# EAGLE design working (EAGLE 9.6.2)
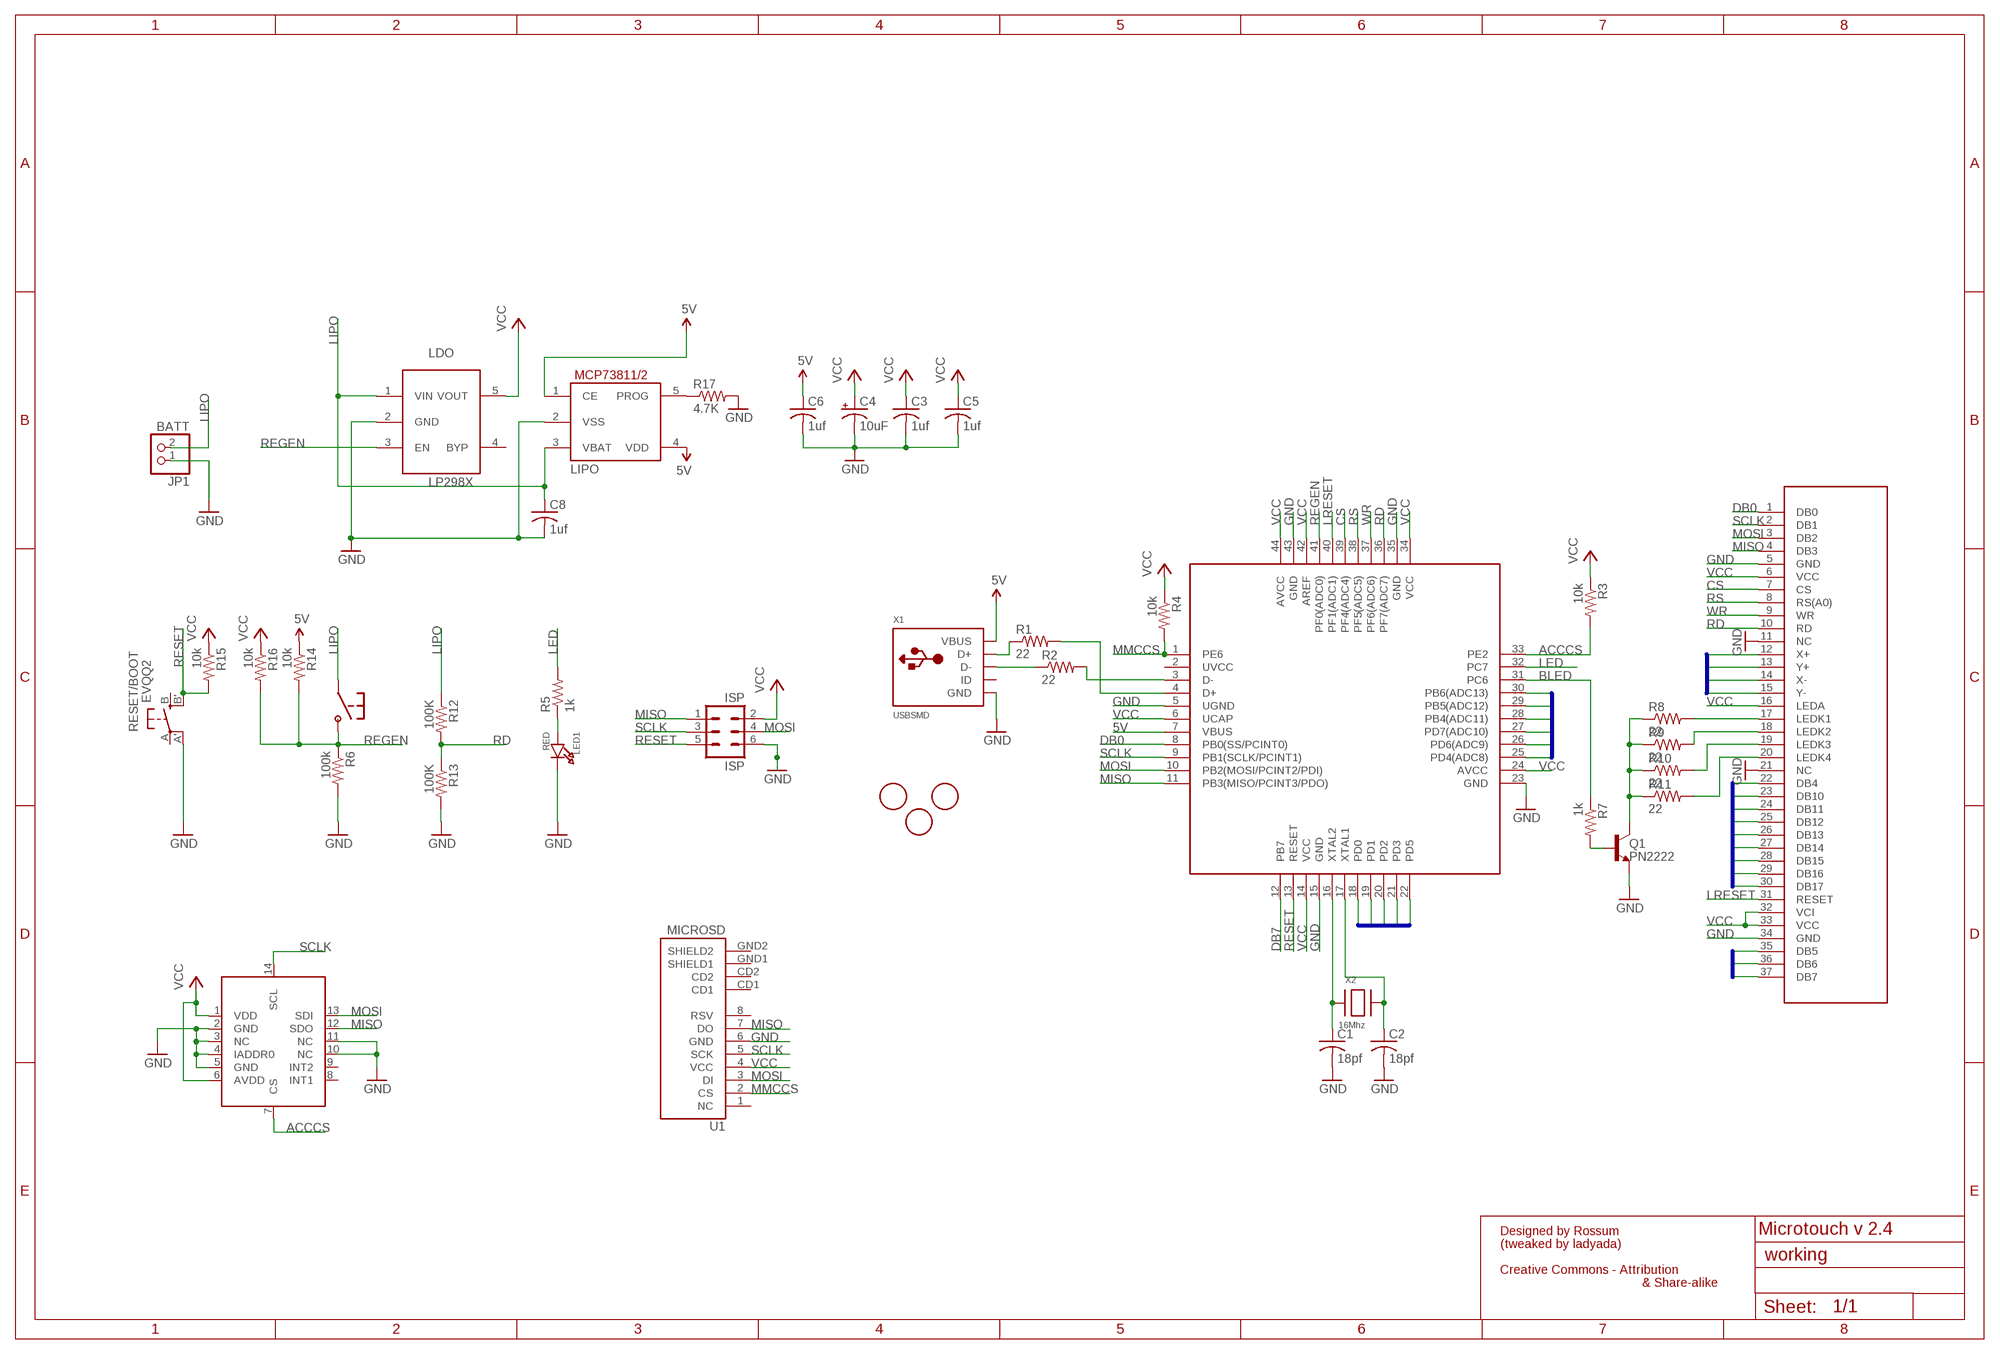
[diagram p0: schematic, sheet 1]

## Parts
ACCELEROMERTER  MMA7455  [LGA]
C1  18pf  C-USC0805K  [C0805K]
C2  18pf  C-USC0805K  [C0805K]
C3  1uf  C-USC0805K  [C0805K]
C4  10uF  CPOL-USA/3216-18R  [A/3216-18R]
C5  1uf  C-USC0805K  [C0805K]
C6  1uf  C-USC0805K  [C0805K]
C8  1uf  C-USC0805K  [C0805K]
ISP  ISP  MA03-2  [MA03-2]
JP1  BATT  JST_2PIN  [JSTPH2]
LDO  LP298XS  [SOT23-5L]
LED1  RED  LED0805  [CHIPLED_0805]
LIPO  MCP73811/2  [SOT23-5L]
Q1  PN2222  MMBT2222ALT1-NPN-SOT23-BEC  [SOT23-BEC]
R1  22  R-US_R0805  [R0805]
R2  22  R-US_R0805  [R0805]
R3  10k  R-US_M0805  [M0805]
R4  10k  R-US_R0805  [R0805]
R5  1k  R-US_R0805  [R0805]
R6  100k  R-US_R0805  [R0805]
R7  1k  R-US_R0805  [R0805]
R8  22  R-US_R0805  [R0805]
R9  22  R-US_R0805  [R0805]
R10  22  R-US_R0805  [R0805]
R11  22  R-US_R0805  [R0805]
R12  100K  R-US_M0805  [M0805]
R13  100K  R-US_M0805  [M0805]
R14  10k  R-US_R0805  [R0805]
R15  10k  R-US_M0805  [M0805]
R16  10k  R-US_R0805  [R0805]
R17  4.7K  R-US_M0805  [M0805]
RESET/BOOT  EVQQ2  [EVQ-Q2]
U1  MICROSD  USD-SOCKETNEW  [MICRO-SD-SOCKET-PP]
U2  KSSMINISWITCH  [KSSMINI]
U$1  ATMEGA32U4  ATMEGA32U4TQFP  [TQFP44]
U$2  LCD37  [LCD371MM]
U$6  FIDUCIAL  [FIDUCIAL_1MM]
U$7  FIDUCIAL  [FIDUCIAL_1MM]
U$8  FIDUCIAL  [FIDUCIAL_1MM]
X1  USBSMD  USBMINIB  [USB-MINIB]
X2  16Mhz  XTALNX5032  [NX5032]

## Nets
5V [power]: C6.1 LIPO.1(CE) LIPO.4(VDD) R14.1 U$1.7(VBUS) X1.VBUS
ACCCS: ACCELEROMERTER.7(CS) R3.2 U$1.33(PE2)
BLED: R7.1 U$1.31(PC6)
CS: U$1.39(PF4(ADC4)) U$2.7(CS)
DB0: U$1.8(PB0(SS/PCINT0)) U$2.1(DB0)
DB4: U$1.28(PB4(ADC11)) U$2.12(X+) U$2.22(DB4)
DB5: U$1.29(PB5(ADC12)) U$2.13(Y+) U$2.35(DB5)
DB6: U$1.30(PB6(ADC13)) U$2.36(DB6)
DB7: U$1.12(PB7) U$2.37(DB7)
DB8: U$1.18(PD0) U$2.23(DB10)
DB9: U$1.19(PD1) U$2.24(DB11)
DB10: U$1.20(PD2) U$2.25(DB12)
DB11: U$1.21(PD3) U$2.26(DB13)
DB12: U$1.25(PD4(ADC8)) U$2.27(DB14)
DB13: U$1.22(PD5) U$2.28(DB15)
DB14: U$1.26(PD6(ADC9)) U$2.14(X-) U$2.29(DB16)
DB15: U$1.27(PD7(ADC10)) U$2.15(Y-) U$2.30(DB17)
GND [power]: ACCELEROMERTER.2(GND) ACCELEROMERTER.3(NC) ACCELEROMERTER.4(IADDR0) ACCELEROMERTER.5(GND) ACCELEROMERTER.10(NC) ACCELEROMERTER.11(NC) C1.2 C2.2 C3.2 C4.- C5.2 C6.2 C8.2 ISP.6 JP1.1 LDO.2(GND) LED1.C LIPO.2(VSS) Q1.E R6.2 R13.2 R17.2 RESET/BOOT.A'(P1) U1.6(GND) U$1.5(UGND) U$1.15(GND) U$1.23(GND) U$1.35(GND) U$1.43(GND) U$2.5(GND) U$2.11(NC) U$2.21(NC) U$2.34(GND) X1.GND
LED: R5.2 U$1.32(PC7)
LIPO [power]: C8.1 JP1.2 LDO.1(VIN) LIPO.3(VBAT) R12.1 U2.P$1
LRESET: U$1.40(PF1(ADC1)) U$2.31(RESET)
MISO: ACCELEROMERTER.12(SDO) ISP.1 U1.7(DO) U$1.11(PB3(MISO/PCINT3/PDO)) U$2.4(DB3)
MMCCS: R4.2 U1.2(CS) U$1.1(PE6)
MOSI: ACCELEROMERTER.13(SDI) ISP.4 U1.3(DI) U$1.10(PB2(MOSI/PCINT2/PDI)) U$2.3(DB2)
N$1 [power]: LIPO.5(PROG) R17.1
N$7: R1.1 X1.D+
N$8: R2.1 X1.D-
N$9: R10.2 U$2.19(LEDK3)
N$10: R8.2 U$2.17(LEDK1)
N$11: R9.2 U$2.18(LEDK2)
N$12: R11.2 U$2.20(LEDK4)
N$13: Q1.C R8.1 R9.1 R10.1 R11.1
N$14: Q1.B R7.2
N$16: LED1.A R5.1
N$32: R1.2 U$1.4(D+)
N$33: R2.2 U$1.3(D-)
RD: R12.2 R13.1 U$1.36(PF7(ADC7)) U$2.10(RD)
REGEN: LDO.3(EN) R6.1 R14.2 R16.2 U2.P$2 U$1.41(PF0(ADC0))
RESET: ISP.5 R15.2 RESET/BOOT.B'(S1) U$1.13(RESET)
RS: U$1.38(PF5(ADC5)) U$2.8(RS(A0))
SCLK: ACCELEROMERTER.14(SCL) ISP.3 U1.5(SCK) U$1.9(PB1(SCLK/PCINT1)) U$2.2(DB1)
VCC [power]: ACCELEROMERTER.1(VDD) ACCELEROMERTER.6(AVDD) C3.1 C4.+ C5.1 ISP.2 LDO.5(VOUT) R3.1 R4.1 R15.1 R16.1 U1.4(VCC) U$1.6(UCAP) U$1.14(VCC) U$1.24(AVCC) U$1.34(VCC) U$1.42(AREF) U$1.44(AVCC) U$2.6(VCC) U$2.16(LEDA) U$2.32(VCI) U$2.33(VCC)
WR: U$1.37(PF6(ADC6)) U$2.9(WR)
XTAL1: C1.1 U$1.16(XTAL2) X2.P$1
XTAL2: C2.1 U$1.17(XTAL1) X2.P$2
Unconnected: ACCELEROMERTER.8(INT1) ACCELEROMERTER.9(INT2) LDO.4(BYP) RESET/BOOT.A(P) RESET/BOOT.B(S) U1.1(NC) U1.8(RSV) U1.CD1 U1.CD2 U1.GND1(SHIELD1) U1.GND2(SHIELD2) U$1.2(UVCC) X1.ID

## Buses
DB[0..15]

## Notes on the sheet
- Designed by Rossum | Microtouch v 2.4
- (tweaked by ladyada)
- Creative Commons - Attribution
- & Share-alike

## Library data of the parts
ACCELEROMERTER = PeterAtMega644:MMA7455
C1-C3 C5 C6 C8 = adafruit:C-US: CAPACITOR, American symbol
C4 = adafruit:CPOL-US: POLARIZED CAPACITOR, American symbol
ISP = con-lstb:MA03-2: PIN HEADER
JP1 = microbuilder:JST_2PIN: JST 2-Pin Right-Angle Connector 4UConnector: 17311
LDO = adafruit:LP298X
LED1 = microbuilder:LED: LED 0603 - 0603 Surface Mount Package Green LED - Low Power (3.9mcd, 2ma, 1.7Vf) Orange LED - Low Power (9.8mcd, 2ma, 1.8Vf) Red LED - Low Power (5mcd, 2ma, 1.8Vf) Yellow LED - Low Power (7mcd, 2ma, 1.8Vf) 0805 - 0805 Surface Mount Package Red LED (104mcd, 20mA, Diffused) - LS R976 [Digikey: 475-1278-6-ND] Red LED (12mcd, 20mA, 2.0Vf, Clear) - APT2012EC [Digikey: 754-1128-1-ND] Red LED (8.8mcd, 2mA, 1.8Vf, Clear) - Low Power [Digikey: 475-2510-1-ND] Green LED (15mcd, 20mA, 2.2Vf, Clear) - APT2012GC [Digikey: 754-1131-1-ND] Green LED (5mcd, 2mA, 1.8Vf, Clear) - Low Power [Digikey: 475-2730-1-ND] Orange LED (160mcd, 20mA, 2.1Vf, Clear) - APT2012SECK [Digikey: 754-1130-1-ND] 1206 - 1206 Surface Mount Package Green LED (26mcd, 20mA, Diffused) - LG N971 [Digikey: 475-1407-6-ND] Red LED (15mcd, 20mA, Diffused) - LH N974 [Digikey: 475-1416-6-ND]
LIPO = adafruit:MCP73811/2: MCP73811 and MCP73812 Simple, Miniature Single-Cell, Fully Integrated Li-Ion / Li-Polymer Charge Management Controllers SOT-23-5 package, no indicator LED but with adjustable current, small and very inexpensive
Q1 = transistor-neu-to92:*-NPN-: NPN Transistror
R1-R17 = adafruit:R-US_: RESISTOR, American symbol
RESET/BOOT = adafruit:EVQQ2: SMT 6mm switch, EVQQ2 series http://www.ladyada.net/library/eagle
U1 = SparkFun:USD-SOCKET: microSD Socket Push-push type uSD socket. Schematic element and footprint production proven. Spark Fun Electronics SKU : PRT-00127. tDoc lines correctly indicate media card edge positions when inserting (unlocked, locked, depressed).
U2 = PeterAtMega644:KSSMINISWITCH
U$1 = PeterAtMega644:ATMEGA32U4
U$2 = PeterAtMega644:LCD37: 2.4 Inch LCD Panel JCTTQ2437PS01-T01
U$6-U$8 = adafruit:FIDUCIAL: For use by pick and place machines to calibrate the vision/machine, 1mm By microbuilder.eu
X1 = adafruit:USB: USB Connectors USBMINIB - Surface Mount Female Mini-B USB Connector 4UConnector: 06564 By microbuilder.eu Thru-hole RA Female Mini-B USB Connector 4UConnector: 18732 By ladyada.net
X2 = adafruit:XTAL: Low cost SMT crystals, no capacitors included http://www.ladyada.net/library/eagle

## Net classes
0 default: width 0.254 mm, drill 0.406 mm, clearance 0.254 mm
1 power: width 0.356 mm, drill 0.406 mm, clearance 0.254 mm

## Board
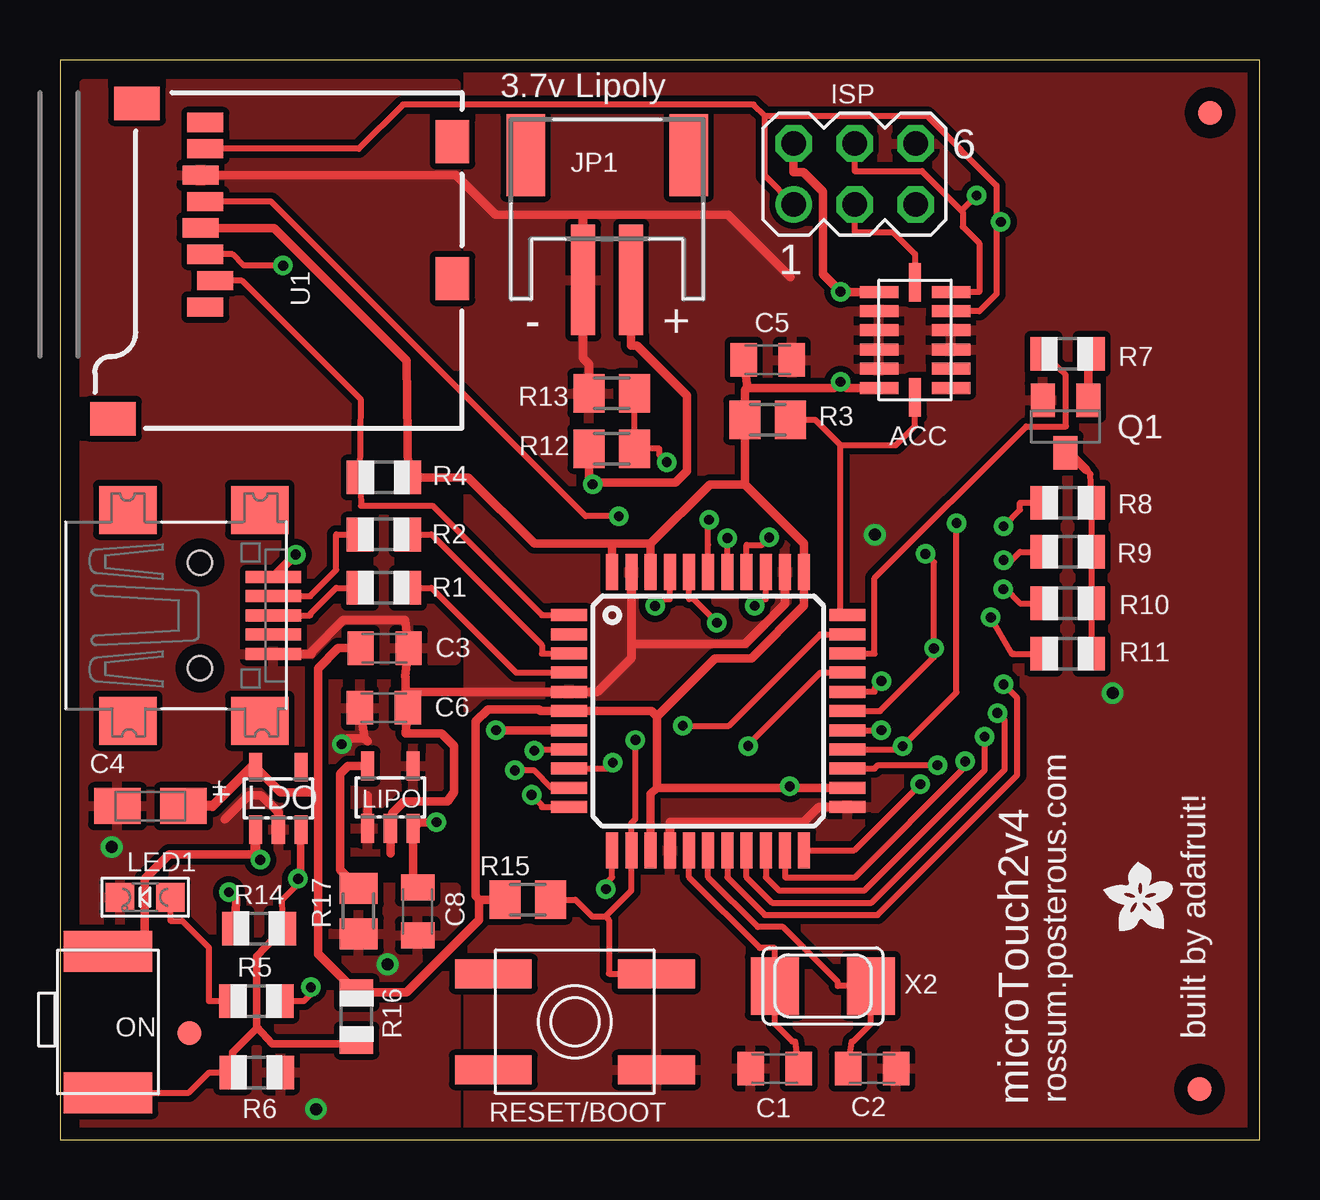
[diagram p1: board, top side]
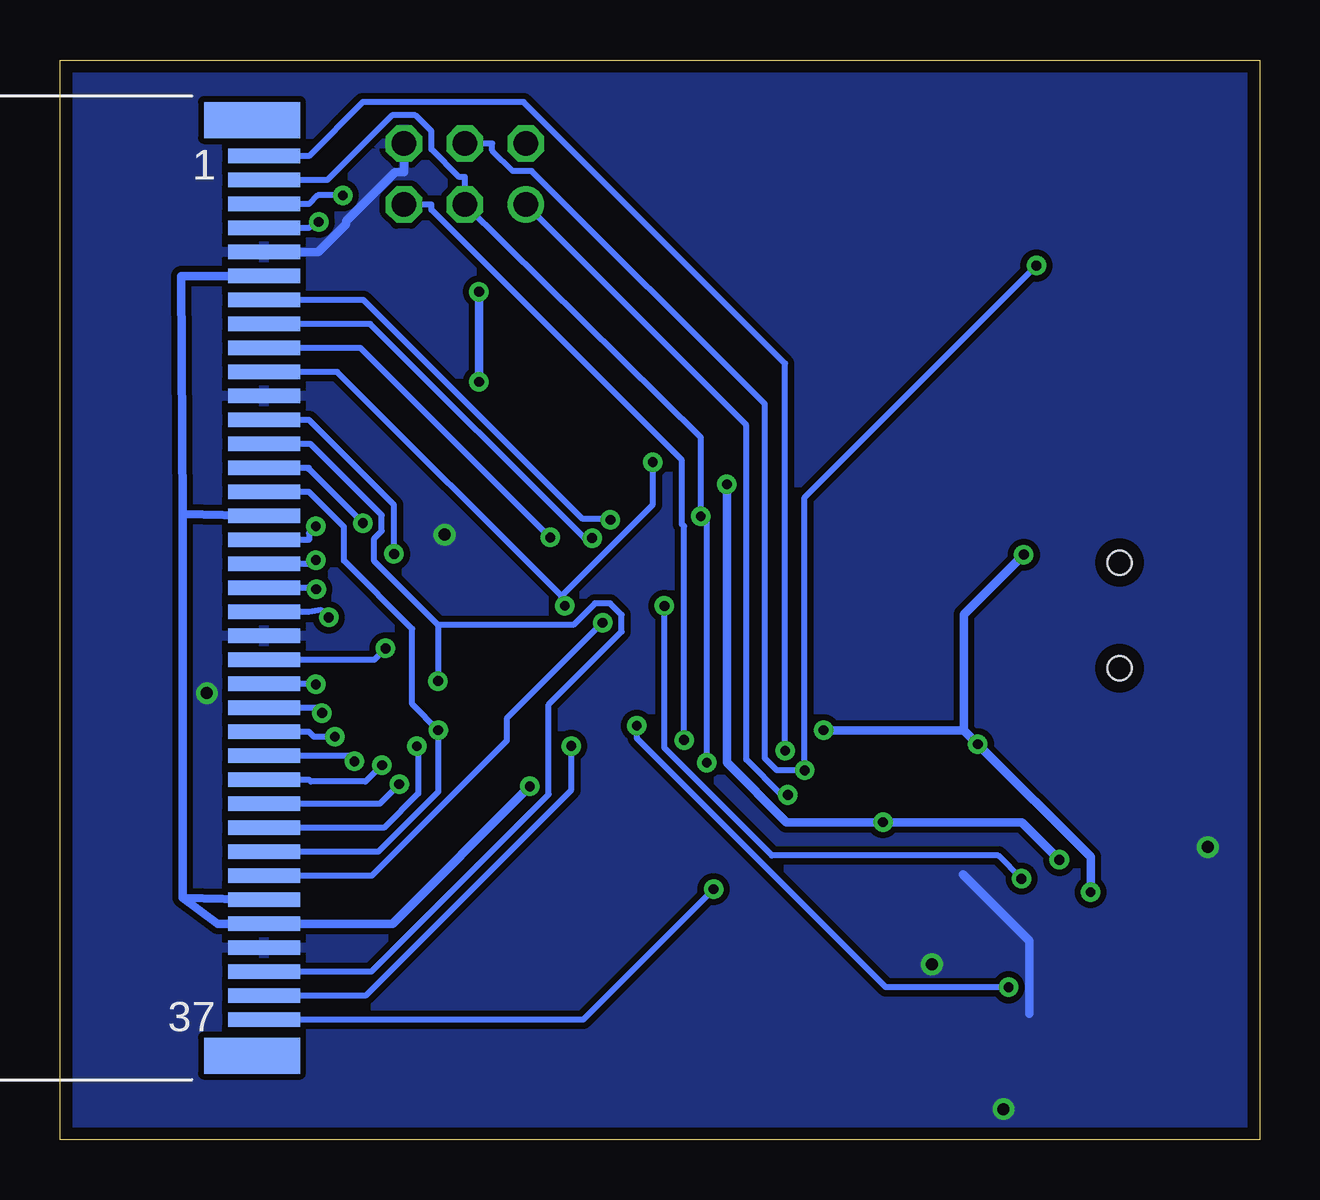
[diagram p2: board, bottom side, seen from below]

Size 50 x 45 mm. Coordinates in mm from the lower left corner, seen from the top.
Outline: 0,0 50,0 50,45 0,45 0,0
Copper layers (1*16): Top 0.035mm / dielectric 1.5mm / Bottom 0.035mm
Design rules "default *": minimum track width 9mil, minimum drill 16mil, track to track 8mil, track to pad 8mil, pad to pad 8mil, via to via 8mil, smd to smd 8mil, copper to edge 20mil, drill to drill 8mil, minimum pad ring 10mil, minimum via ring 8mil, stop-mask expansion 4mil, vias tented up to drill 20mil, thermal gap 10mil

### Footprints (pad centres in the part's own frame; a part is rotated, then mirrored left to right if it is on the bottom)
LGA = smd 1.6 x 0.5: 1 -1.5,2; 2 -1.5,1.2; 3 -1.5,0.4; 4 -1.5,-0.4; 5 -1.5,-1.2; 6 -1.5,-2; 8 1.5,-2; 9 1.5,-1.2; 10 1.5,-0.4; 11 1.5,0.4; 12 1.5,1.2; 13 1.5,2 | smd 0.5 x 1.6: 7 0,-2.4; 14 0,2.4
C0805K = smd 1.1 x 1.4: 1 -1,0; 2 1,0
A/3216-18R = smd 1.95 x 1.5: + 1.375,0; - -1.375,0
MA03-2 = drill 1.016: 1 -2.54,-1.27 | drill 1.016 octagon: 2 -2.54,1.27; 3 0,-1.27; 4 0,1.27; 5 2.54,-1.27; 6 2.54,1.27
JSTPH2 = smd 1 x 4.6: 1 -1,-3.7; 2 1,-3.7 | smd 1.6 x 3.4: NC1 -3.4,1.5; NC2 3.4,1.5
SOT23-5L = smd 0.55 x 1.2: 1 -0.95,-1.3; 2 0,-1.3; 3 0.95,-1.3; 4 0.95,1.3; 5 -0.95,1.3
CHIPLED_0805 = smd 1.2 x 1.2: A 0,-1.05; C 0,1.05
SOT23-BEC = smd 1 x 1.4: B -0.95,-1.1; C 0,1.1; E 0.95,-1.1
R0805 = smd 1.1 x 1.4: 1 -1,0; 2 1,0
M0805 = smd 1.3 x 1.6: 1 -0.95,0; 2 0.95,0
EVQ-Q2 = smd 3.2 x 1.2: A -3.4,-2; A' 3.4,-2; B -3.4,2; B' 3.4,2
MICRO-SD-SOCKET-PP = smd 0.8 x 1.5: 1 -8.94,10.7; 2 -7.84,10.3; 3 -6.74,10.7; 4 -5.64,10.9; 5 -4.54,10.7; 6 -3.44,10.9; 7 -2.34,10.7; 8 -1.24,10.7 | smd 1.4 x 1.9: CD1 -0.45,13.55; GND1 -13.6,14.55 | smd 1.8 x 1.4: CD2 -2.05,0.4; GND2 -7.75,0.4
KSSMINI = smd 1.7 x 3.7: P$1 -2.85,0; P$2 3.05,0
TQFP44 = smd 1.5 x 0.5: 1 -5.8,4; 2 -5.8,3.2; 3 -5.8,2.4; 4 -5.8,1.6; 5 -5.8,0.8; 6 -5.8,0; 7 -5.8,-0.8; 8 -5.8,-1.6; 9 -5.8,-2.4; 10 -5.8,-3.2; 11 -5.8,-4; 23 5.8,-4; 24 5.8,-3.2; 25 5.8,-2.4; 26 5.8,-1.6; 27 5.8,-0.8; 28 5.8,0; 29 5.8,0.8; 30 5.8,1.6; 31 5.8,2.4; 32 5.8,3.2; 33 5.8,4 | smd 0.5 x 1.5: 12 -4,-5.8; 13 -3.2,-5.8; 14 -2.4,-5.8; 15 -1.6,-5.8; 16 -0.8,-5.8; 17 0,-5.8; 18 0.8,-5.8; 19 1.6,-5.8; 20 2.4,-5.8; 21 3.2,-5.8; 22 4,-5.8; 34 4,5.8; 35 3.2,5.8; 36 2.4,5.8; 37 1.6,5.8; 38 0.8,5.8; 39 0,5.8; 40 -0.8,5.8; 41 -1.6,5.8; 42 -2.4,5.8; 43 -3.2,5.8; 44 -4,5.8
LCD371MM = smd 3 x 0.6: 1 0,18; 2 0,17; 3 0,16; 4 0,15; 5 0,14; 6 0,13; 7 0,12; 8 0,11; 9 0,10; 10 0,9; 11 0,8; 12 0,7; 13 0,6; 14 0,5; 15 0,4; 16 0,3; 17 0,2; 18 0,1; 19 0,0; 20 0,-1; 21 0,-2; 22 0,-3; 23 0,-4; 24 0,-5; 25 0,-6; 26 0,-7; 27 0,-8; 28 0,-9; 29 0,-10; 30 0,-11; 31 0,-12; 32 0,-13; 33 0,-14; 34 0,-15; 35 0,-16; 36 0,-17; 37 0,-18 | smd 4 x 1.5: P$1 -0.5,19.5; P$2 -0.5,-19.5
FIDUCIAL_1MM = smd 1 x 1: 1 0,0
USB-MINIB = smd 0.5 x 2.308: D+ 0,4.064; D- -0.8,4.064; GND 1.6,4.064; ID 0.8,4.064; VBUS -1.6,4.064 | smd 2 x 2.4: GND1 -4.4,-2; GND2 -4.4,3.5; GND3 4.4,3.5; GND4 4.4,-2 | hole 1: -2.2,1; 2.2,1
NX5032 = smd 2 x 2.4: P$1 2,0; P$2 -2,0

### Placement (x,y rotation side)
ACCELEROMERTER  35.64,33.33 0 top
C1  29.79,2.96 180 top
C2  33.85,2.96 0 top
C3  13.53,20.48 0 top
C4  3.77,13.9 0 top
C5  29.5,32.5 0 top
C6  13.5,18 0 top
C8  14.91,9.51 270 top
ISP  33.12,40.24 0 top
JP1  22.81,39.53 0 top
LDO  9.1,14.22 0 top
LED1  3.55,10.1 90 top
LIPO  13.77,14.27 0 top
Q1  41.91,29.72 180 top
R1  13.5,23 0 top
R2  13.5,25.22 0 top
R3  29.5,30 0 top
R4  13.5,27.6 180 top
R5  8.19,5.78 0 top
R6  8.2,2.8 0 top
R7  42,32.75 0 top
R8  42,26.55 180 top
R9  42,24.5 180 top
R10  42,22.35 180 top
R11  42,20.25 180 top
R12  23,28.8 0 top
R13  23,31.1 180 top
R14  8.3,8.8 0 top
R15  19.5,10 0 top
R16  12.36,5.13 270 top
R17  12.45,9.53 270 top
RESET/BOOT  21.46,4.91 0 top
U1  16.76,43.64 90 top
U2  2,5 270 top
U$1  27.02,17.86 0 top
U$2  41.5,23 0 bottom
U$6  47.5,2.1 0 top
U$7  47.94,42.8 0 top
U$8  5.4,4.45 0 top
U$9  [ADAFRUIT200MIL]  44.83,10.1 0 top
X1  4.83,21.85 270 top
X2  31.8,6.4 180 top

### Tracks (layer width: path | path; a pad name or v marks a point on that pad's centre or on a via)
5V  (via drill 0.41 pad 0.81)
  Top 0.356: v7.04,10.31 7.32,10.03 7.35,10.03 R14.1 | v11.74,16.48 11.99,16.72 12.7,16.72 | 12.7,16.72 C6.1 | 12.7,16.72 12.82,16.6 | v9.82,24.38 X1.VBUS | v18.17,17.06 U$1.7 | LIPO.1 12.83,14.35
  Bottom 0.356: v7.04,10.31 7.04,11.77 v11.74,16.48 12.32,17.06 | 12.32,17.06 v18.17,17.06 | 12.32,17.06 12.32,21.88 v9.82,24.38
  pour Top: 11,19 16,19 16,12 11,12
ACCCS
  Top 0.254: ACCELEROMERTER.7 35.64,29.75 34.84,28.94 32.54,28.94 | 32.54,28.94 31.48,30 R3.2 | 32.54,28.94 32.54,21.86 U$1.33
BLED
  Top 0.254: U$1.31 33.95,20.26 33.95,23.4 40.27,29.72 41.93,29.72 41.92,30.09 41.92,31.88 R7.1
CS  (via drill 0.41 pad 0.81)
  Top 0.254: v27.05,25.84 27.02,25.8 27.02,24.79 U$1.39
  Bottom 0.254: U$2.7 37.35,35 28.21,25.87 27.09,25.87 v27.05,25.84
DB0  (via drill 0.41 pad 0.81)
  Top 0.254: v19.77,16.21 19.83,16.26 U$1.8
  Bottom 0.254: U$2.1 39.62,41 37.38,43.24 30.67,43.24 19.77,32.34 v19.77,16.21
DB4  (via drill 0.41 pad 0.81)
  Top 0.254: v36.08,24.41 36.43,24.06 v36.43,20.47 36.43,20.11 34.19,17.86 33.95,17.86 U$1.28
  Bottom 0.254: v36.08,24.41 36.08,26.46 39.62,30 U$2.12 | v36.43,20.47 36.91,20 39.62,20 U$2.22
DB5  (via drill 0.41 pad 0.81)
  Top 0.254: v34.24,19.11 33.95,18.82 33.95,18.66 U$1.29
  Bottom 0.254: 34.24,21.46 28.6,21.46 27.71,22.35 27.07,22.35 26.59,21.88 26.59,21.17 29.63,18.12 29.63,14.39 37.03,7 39.62,7 U$2.35 | 34.24,21.46 36.9,24.11 36.9,25.05 36.58,25.37 36.58,26.02 39.56,29 39.62,29 U$2.13 | 34.24,21.46 v34.24,19.11
DB6  (via drill 0.41 pad 0.81)
  Top 0.254: v28.69,16.41 28.69,16.46 31.69,19.46 U$1.30
  Bottom 0.254: v28.69,16.41 28.69,14.57 37.26,6 39.62,6 U$2.36
DB7  (via drill 0.41 pad 0.81)
  Top 0.254: U$1.12 23.02,10.93 22.76,10.67 v22.76,10.44
  Bottom 0.254: U$2.37 28.19,5 v22.76,10.44
DB8  (via drill 0.41 pad 0.81)
  Top 0.254: v39.34,18.97 39.9,18.41 39.9,15.19 34.08,9.36 29.39,9.36 27.82,10.93 U$1.18
  Bottom 0.254: v39.34,18.97 39.36,19 U$2.23
DB9  (via drill 0.41 pad 0.81)
  Top 0.254: v39.08,17.78 39.38,17.47 39.38,15.42 33.83,9.87 29.68,9.87 28.62,10.93 U$1.19
  Bottom 0.254: v39.08,17.78 39.3,18 U$2.24
DB10  (via drill 0.41 pad 0.81)
  Top 0.254: v38.55,16.79 38.55,15.4 33.53,10.38 29.97,10.38 29.42,10.93 U$1.20
  Bottom 0.254: U$2.25 39.62,17 39.41,16.79 v38.55,16.79
DB11  (via drill 0.41 pad 0.81)
  Top 0.254: U$1.21 30.22,10.93 33.13,10.93 37.73,15.53 v37.73,15.76
  Bottom 0.254: U$2.26 37.97,16 v37.73,15.76
DB12  (via drill 0.41 pad 0.81)
  Top 0.254: v36.57,15.61 34.1,15.61 33.95,15.46 U$1.25
  Bottom 0.254: v36.57,15.61 37.26,14.92 39.54,14.92 39.62,15 U$2.27
DB13  (via drill 0.41 pad 0.81)
  Top 0.254: U$1.22 33.11,12.06 v35.86,14.81
  Bottom 0.254: U$2.28 36.67,14 v35.86,14.81
DB14  (via drill 0.41 pad 0.81)
  Top 0.254: v37.37,25.7 37.37,18.64 v35.12,16.39 34.99,16.26 U$1.26
  Bottom 0.254: U$2.14 39.62,28 39.62,27.94 v37.37,25.7 | U$2.29 36.5,13 35.07,14.43 35.07,16.34 v35.12,16.39
DB15  (via drill 0.41 pad 0.81)
  Top 0.254: U$1.27 v34.23,17.06
  Bottom 0.254: U$2.30 39.62,12 36.73,12 34.23,14.5 v34.23,17.06 35.32,18.15 35.32,21.29 38.16,24.13 38.16,25.54 39.62,27 U$2.15
GND  (via drill 0.5)
  Top 0.356: 21.81,38.56 27.84,38.56 30.45,35.96 | U1.6 16.51,40.2 18.15,38.56 21.81,38.56 | 23.82,20.66 U$1.43 | 23.82,20.66 23.82,20.08 22.4,18.66 U$1.5 14.4,18.66 | 23.82,20.66 28.56,20.66 30.22,22.32 U$1.35 | 14.4,18.66 C6.2 14.4,16.92 15.91,16.92 16.43,16.4 16.43,14.48 16.15,14.1 14.35,14.1 13.84,13.59 13.84,13.04 LIPO.2 13.77,11.94 | X1.GND 10.48,20.25 10.48,20.33 11.81,21.66 14.38,21.66 C3.2 14.38,19.3 14.4,19.28 14.4,18.66 | U$1.23 31.64,13.86 31.02,13.24 25.42,13.24 U$1.15 | 21.81,38.56 JP1.1 21.81,32.57 22.05,32.33 R13.2 | LDO.2 9.1,13.63 8.38,14.35 7.87,14.35 6.86,13.34
  Bottom 0.356: 9.59,5.24 9.59,8.27 12.37,11.05 | U$2.5 39.24,37 38.08,38.16 38.08,38.27 36.02,40.32 35.66,40.32 ISP.6
  other vias: 2.16,12.19 10.67,1.27 13.65,7.3 33.97,25.21 43.88,18.61
  pour Top: 1,0 16.5,0 16.5,10.5 10,10.5 10,20 16.5,20 16.5,44 1,44
  pour Top: 17,0.5 49.5,0.5 49.75,45 17,45
  pour Bottom: 0,0 50,0 50,45 0,45
LED  (via drill 0.41 pad 0.81)
  Top 0.254: v25.95,17.25 27.88,17.25 31.69,21.06 U$1.32 | v10.46,6.34 10.46,6.07 10.17,5.78 R5.2
  Bottom 0.254: v25.95,17.25 25.95,16.73 15.57,6.34 v10.46,6.34
LIPO  (via drill 0.41 pad 0.81)
  Top 0.356: 22.24,27.38 25.66,27.38 26.14,27.86 26.14,31 24.04,33.1 23.81,33.1 JP1.2 | 22.24,27.38 22.05,27.57 R12.1 | 22.24,27.38 22.24,27.35 v22.2,27.31 | v15.7,13.23 14.98,13.23 LIPO.3 14.72,10.89 14.97,10.64 C8.1 | U2.P$1 3.53,8.38 3.53,10.87 4.55,11.89 8.15,11.89 8.15,11.85 8.15,11.86 8.15,11.89
  Top 0.406: v8.34,11.66 8.34,11.7 8.15,11.89 LDO.1
  Bottom 0.356: v22.2,27.31 22.2,15.72 19.71,13.23 v15.7,13.23 9.92,13.23 v8.34,11.66
LRESET  (via drill 0.41 pad 0.81)
  Top 0.254: U$1.40 26.22,22.53 26.4,22.53 v27.38,21.54
  Bottom 0.254: v27.38,21.54 31.38,17.54 31.38,16.62 37,11 39.62,11 U$2.31
MISO  (via drill 0.41 pad 0.81)
  Top 0.254: U$1.11 20.09,13.86 20.09,13.94 v19.66,14.37 | 39.04,38.25 v39.22,38.25 | 39.04,38.25 39.04,35.25 38.32,34.53 ACCELEROMERTER.12 | 29.38,42.67 36.13,42.67 39.04,39.76 39.04,38.25 | U1.7 12.46,41.3 14.3,43.14 28.91,43.14 29.38,42.67 | 29.38,42.67 29.38,40.18 ISP.1
  Bottom 0.254: ISP.1 21.39,29.78 21.39,15.83 19.92,14.37 v19.66,14.37 | U$2.4 39.62,38 39.37,38.25 v39.22,38.25
MMCCS
  Top 0.254: U$1.1 20.09,21.86 15.53,26.42 12.55,26.42 R4.2 12.55,30.84 7.59,35.8 U1.2
MOSI  (via drill 0.41 pad 0.81)
  Top 0.254: U$1.10 20.48,14.66 19.75,15.39 v18.96,15.39 | v9.3,36.43 7.66,36.43 7.19,36.9 U1.3 | 37.58,38.72 37.63,38.66 37.63,38.05 38.32,37.36 38.32,35.33 ACCELEROMERTER.13 | 37.58,38.72 v38.21,39.36 | 37.58,38.72 35.93,40.37 33.12,40.37 ISP.4
  Bottom 0.254: v9.3,36.43 18.96,26.77 v18.96,15.39 20.12,15.39 20.62,15.89 20.62,30.66 30.34,40.37 31.12,40.37 31.98,41.23 31.98,41.51 ISP.4 | v38.21,39.36 39.26,39.36 39.62,39 U$2.3
N$1
  Top 0.356: R17.1 11.68,11.24 11.68,15.24 12.01,15.57 LIPO.5
N$7
  Top 0.254: X1.D+ 10.43,21.85 10.43,21.91 11.52,23 R1.1
N$8
  Top 0.254: R2.1 11.52,25.22 11.52,23.74 10.43,22.65 X1.D-
N$9  (via drill 0.41 pad 0.81)
  Top 0.254: v39.32,22.94 39.43,22.94 40.02,22.35 R10.2
  Bottom 0.254: U$2.19 39.38,23 v39.32,22.94
N$10  (via drill 0.41 pad 0.81)
  Top 0.254: R8.2 40.02,26.55 40.02,26.25 v39.33,25.57
  Bottom 0.254: U$2.17 39.62,25 39.62,25.28 v39.33,25.57
N$11  (via drill 0.41 pad 0.81)
  Top 0.254: R9.2 40.02,24.5 39.67,24.16 v39.34,24.16
  Bottom 0.254: U$2.18 39.62,24 39.46,24.16 v39.34,24.16
N$12  (via drill 0.41 pad 0.81)
  Top 0.254: v38.8,21.76 39.7,20.22 39.77,20.25 R11.2
  Bottom 0.254: U$2.20 39.62,22 39.11,22.07 v38.8,21.76
N$13
  Top 0.254: 42.78,27.9 42.95,27.73 R8.1 R9.1 R10.1 R11.1
  Top 0.356: 42.78,27.9 42.06,28.62 Q1.C
N$14
  Top 0.356: Q1.B 42.86,32.61 R7.2
N$16
  Top 0.254: LED1.A 4.6,9.12 5.09,9.12 6.21,8 6.21,5.78 R5.1
N$32
  Top 0.254: R1.2 15.48,23 19.02,19.46 U$1.4
N$33
  Top 0.254: U$1.3 20.09,20.26 20.09,20.61 15.48,25.22 R2.2
RD  (via drill 0.41 pad 0.81)
  Top 0.254: v25.29,28.24 24.98,28.54 24.98,28.8 R12.2 R13.1 | U$1.36 29.42,22.53 29.24,22.53 v28.96,22.25
  Bottom 0.254: 29.1,22.66 25.29,26.47 v25.29,28.24 | U$2.10 38.44,32 29.1,22.66 | v28.96,22.25 29.1,22.39 29.1,22.66
REGEN  (via drill 0.41 pad 0.81)
  Top 0.254: U$1.41 25.42,22.53 25.09,22.53 v24.81,22.24 | 10.05,11 v9.92,10.87 9.92,10.65 9.25,9.98 R14.2 | R6.1 6.22,2.8 5.37,1.95 U2.P$2
  Top 0.305: 10.03,10.87 10.03,10.85 | v9.92,10.87 10.03,10.87 | LDO.3 10.03,12.92 10.03,10.87 | R6.1 7.2,3.64 8.13,4.57 8.19,4.7 | 8.19,4.7 8.19,7.63 R14.2 | 12.22,3.98 8.85,3.98 8.19,4.7
  Top 0.356: 12.22,3.98 R16.2
  Bottom 0.254: v24.81,22.24 24.81,16.32 20.32,11.84 10.9,11.84 v9.92,10.87
RESET  (via drill 0.41 pad 0.81)
  Top 0.254: v23.99,16.65 23.99,13.36 23.82,13.19 U$1.13 23.82,11.62 23.82,10.93 23.82,10.38 22.73,9.29 | 22.73,9.29 22.19,9.29 21.48,10 R15.2 | 22.73,9.29 22.88,9.15 22.88,6.91 RESET/BOOT.B'
  Bottom 0.254: v23.99,16.65 23.99,25.56 24.08,25.65 24.08,28.31 34.52,38.76 34.52,38.97 ISP.5
RS  (via drill 0.41 pad 0.81)
  Top 0.254: v27.82,25.07 27.82,24.79 U$1.38
  Bottom 0.254: v27.82,25.07 28.14,25.07 37.06,34 U$2.8
SCLK  (via drill 0.41 pad 0.81)
  Top 0.254: U1.5 8.79,39.1 21.91,25.98 v23.29,25.98 | v23.04,15.71 22.79,15.46 U$1.9 | ACCELEROMERTER.14 35.64,36.91 34.72,37.83 33.12,37.83 ISP.3
  Bottom 0.254: v23.04,15.71 23.04,25.73 v23.29,25.98 23.29,29.27 ISP.3 33.12,40.12 33.36,40.12 34.52,41.28 34.52,42.03 35.18,42.69 36.17,42.69 38.86,40 U$2.2
VCC  (via drill 0.41 pad 0.81)
  Top 0.356: 30.42,14.66 v30.42,14.72 | 24.88,14.66 30.42,14.66 | 30.42,14.66 U$1.24 | 24.62,24.84 23.02,24.84 | 23.02,24.84 19.78,24.84 17.02,27.6 R4.1 14.45,32.48 8.93,38 U1.4 | 28.55,27.31 31.02,24.84 U$1.34 31.02,22.26 28.81,20.05 27.3,20.05 24.88,17.64 | 28.55,27.31 27.09,27.31 24.62,24.84 | 24.62,24.84 U$1.42 | 23.02,24.84 U$1.44 | 28.65,31.32 32.27,31.32 v32.53,31.59 32.79,31.33 ACCELEROMERTER.6 | 28.65,31.32 28.64,31.32 28.55,31.23 R3.1 28.55,27.31 | 24.88,14.66 24.62,14.4 U$1.14 | 24.88,17.64 24.88,14.66 | 24.88,17.64 24.66,17.86 U$1.6 20.04,17.86 19.96,17.94 17.84,17.94 17.32,17.42 17.32,10.15 17.47,10 | 28.65,31.32 C5.1 | 10.76,14.48 10.76,19.64 11.6,20.48 C3.1 | 10.76,14.48 10.76,7.71 10.78,7.71 R16.1 14.44,6.13 17.47,9.15 17.47,10 | 17.47,10 R15.1 | ISP.2 30.58,40.32 30.99,40.32 31.8,39.51 31.8,36.08 v32.53,35.34 32.9,35.34 32.91,35.33 ACCELEROMERTER.1 | 8.15,15.55 8.15,15.54 8.12,15.52 | 8.18,15.49 LDO.5 9.19,14.48 10.76,14.48
  Top 0.406: C4.+ 6.36,13.9 8,15.54 8.15,15.54 | 8.12,15.52 8.08,15.47 | 8.18,15.57 8.15,15.55 LDO.5
  Bottom 0.356: v30.42,14.72 36.14,9 U$2.33 43.43,9 44.89,10.06 | v32.53,31.59 v32.53,35.34 | 44.89,10.06 44.89,26.06 | 44.89,10.06 U$2.32 | 44.89,26.06 U$2.16 | U$2.6 44.96,36 44.89,26.06
WR  (via drill 0.41 pad 0.81)
  Top 0.254: v29.57,25.09 29.27,24.79 28.62,24.79 U$1.37
  Bottom 0.254: v29.57,25.09 37.47,33 U$2.9
XTAL1
  Top 0.254: C1.1 30.64,4.09 30.53,4.09 29.8,4.82 X2.P$1 29.8,7.98 29.17,7.98 26.22,10.93 U$1.16
XTAL2
  Top 0.254: C2.1 33,4.09 33.07,4.09 33.8,4.82 X2.P$2 32.42,6.4 32.42,6.57 30.14,8.86 29.09,8.86 27.02,10.93 U$1.17

### Text on the board
tPlace: 3.7v Lipoly | built by adafruit!
tNames: ACC | + | ON | rossum.posterous.com | microTouch2v4